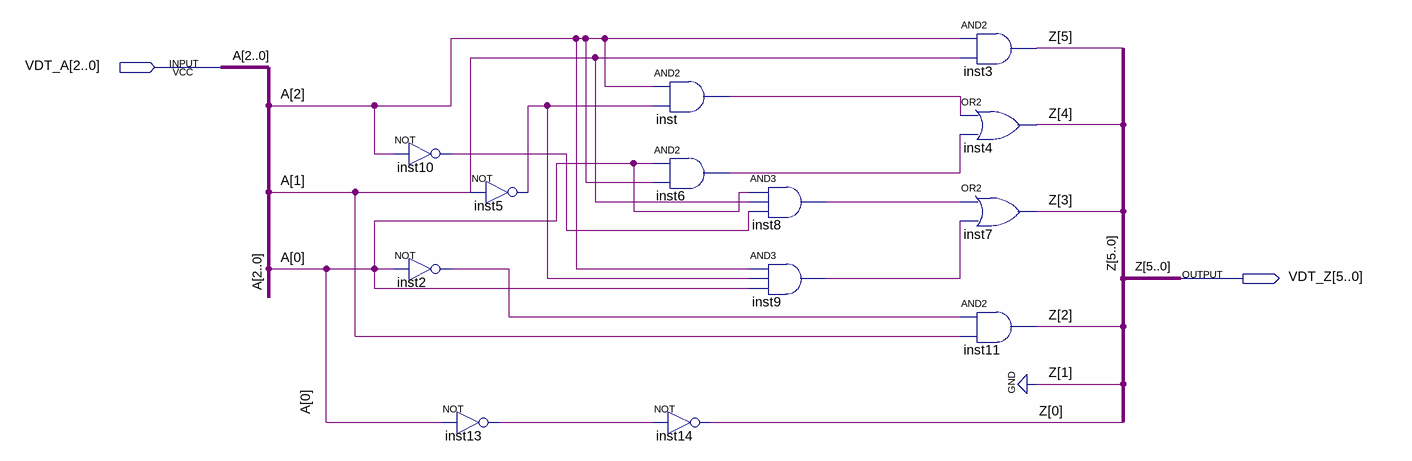
[diagram p0: schematic sheet]
// Quartus schematic Assignment5.bdf as structural Verilog: 13 symbols, 2 pins
module Assignment5 (
  input  [2:0] VDT_A,
  output [5:0] VDT_Z
);

  wire inst2_out, inst5_out, inst6_out, inst8_out, inst9_out, inst10_out, inst13_out, inst_out;

  not inst10 (inst10_out, VDT_A[2]);
  not inst2 (inst2_out, VDT_A[0]);
  not inst5 (inst5_out, VDT_A[1]);
  not inst13 (inst13_out, VDT_A[0]);
  and inst (inst_out, VDT_A[2], inst5_out);
  and inst6 (inst6_out, VDT_A[0], VDT_A[2]);
  not inst14 (VDT_Z[0], inst13_out);
  and inst8 (inst8_out, VDT_A[0], VDT_A[1], inst10_out);
  and inst9 (inst9_out, VDT_A[2], inst5_out, VDT_A[0]);
  and inst3 (VDT_Z[5], VDT_A[2], VDT_A[1]);
  or inst4 (VDT_Z[4], inst_out, inst6_out);
  or inst7 (VDT_Z[3], inst8_out, inst9_out);
  and inst11 (VDT_Z[2], inst2_out, VDT_A[1]);

  assign VDT_Z[1] = 1'b0;

  // Other names for the same wires on the sheet: A[2:0] = VDT_A; Z (some bits) = {VDT_Z[5:2], VDT_Z[0]}
endmodule
